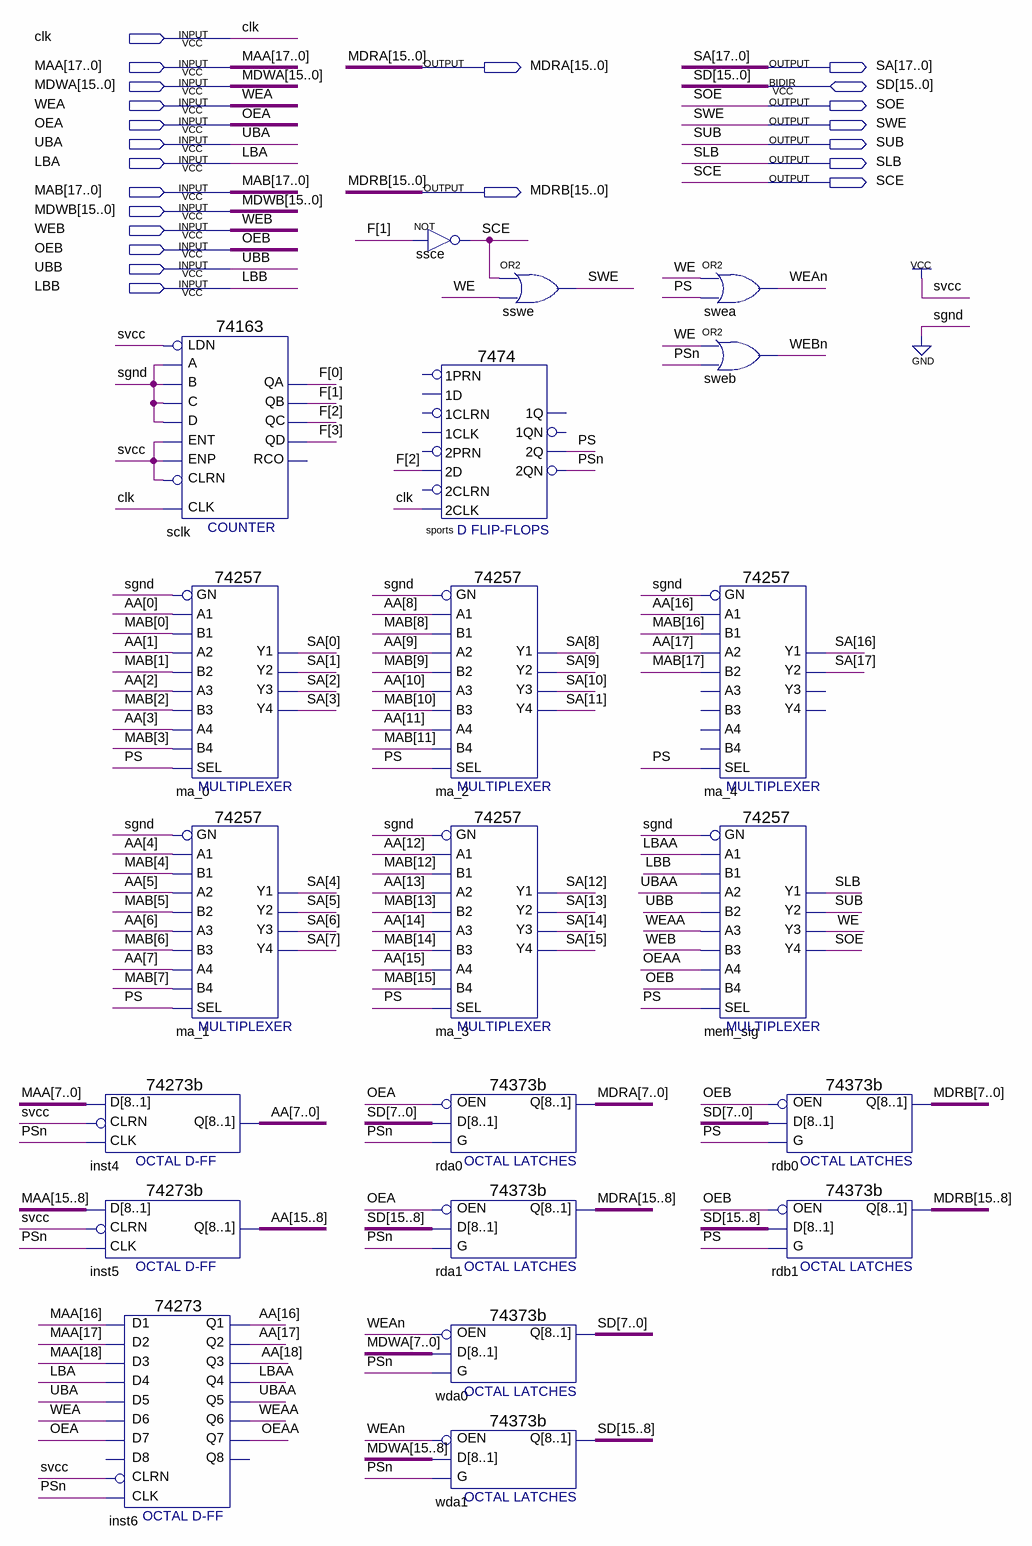
[diagram p0: schematic sheet]
// Quartus schematic orion_memory.bdf as structural Verilog: 21 symbols, 22 pins
module orion_memory (
  input  clk,
  input  [18:0] MAA,
  input  [15:0] MDWA,
  input  WEA,
  input  OEA,
  input  UBA,
  input  LBA,
  input  [17:0] MAB,
  input  [15:0] MDWB,
  input  WEB,
  input  OEB,
  input  UBB,
  input  LBB,
  inout  [15:0] SD,
  output [15:0] MDRA,
  output [17:0] SA,
  output SOE,
  output SWE,
  output SUB,
  output SLB,
  output SCE,
  output [15:0] MDRB
);

  wire LBAA, OEAA, PS, PSn, UBAA, WE, WEAA, WEAn, WEBn;
  wire [3:0] F;
  wire [18:0] AA;

  \74273b  inst4 (.CLK(PSn), .D(MAA[7:0]), .CLRN(1'b1), .Q(AA[7:0]));
  \74273b  inst5 (.CLK(PSn), .D(MAA[15:8]), .CLRN(1'b1), .Q(AA[15:8]));
  \74273  inst6 (
    .D2(MAA[17]), .D3(MAA[18]), .D1(MAA[16]), .D4(LBA), .D7(OEA), .D6(WEA), .D5(UBA), .CLK(PSn), .CLRN(1'b1),
    .Q4(LBAA), .Q1(AA[16]), .Q2(AA[17]), .Q3(AA[18]), .Q6(WEAA), .Q5(UBAA), .Q7(OEAA));  // open: D8, Q8
  \74163  sclk (
    .C(1'b0), .B(1'b0), .A(1'b0), .ENT(1'b1), .D(1'b0), .CLRN(1'b1), .CLK(clk), .ENP(1'b1), .LDN(1'b1),
    .QA(F[0]), .QB(F[1]), .QC(F[2]), .QD(F[3]));  // open: RCO
  \74257  ma_0 (
    .B1(MAB[0]), .A1(AA[0]), .B3(MAB[2]), .A2(AA[1]), .B2(MAB[1]), .A3(AA[2]), .A4(AA[3]), .B4(MAB[3]),
    .SEL(PS), .GN(1'b0), .Y2(SA[1]), .Y3(SA[2]), .Y4(SA[3]), .Y1(SA[0]));
  \74257  ma_1 (
    .B1(MAB[4]), .A1(AA[4]), .B3(MAB[6]), .A2(AA[5]), .B2(MAB[5]), .A3(AA[6]), .A4(AA[7]), .B4(MAB[7]),
    .SEL(PS), .GN(1'b0), .Y2(SA[5]), .Y3(SA[6]), .Y4(SA[7]), .Y1(SA[4]));
  not ssce (SCE, F[1]);
  \7474  sports (
    .\2D (F[2]), .\2CLK (clk), .\2Q (PS), .\2QN (PSn));  // open: 2PRN, 1CLK, 1D, 1PRN, 2CLRN, 1CLRN, 1QN, 1Q
  \74257  ma_2 (
    .B1(MAB[8]), .A1(AA[8]), .B3(MAB[10]), .A2(AA[9]), .B2(MAB[9]), .A3(AA[10]), .A4(AA[11]), .B4(MAB[11]),
    .SEL(PS), .GN(1'b0), .Y2(SA[9]), .Y3(SA[10]), .Y4(SA[11]), .Y1(SA[8]));
  \74257  ma_3 (
    .B1(MAB[12]), .A1(AA[12]), .B3(MAB[14]), .A2(AA[13]), .B2(MAB[13]), .A3(AA[14]), .A4(AA[15]),
    .B4(MAB[15]), .SEL(PS), .GN(1'b0), .Y2(SA[13]), .Y3(SA[14]), .Y4(SA[15]), .Y1(SA[12]));
  \74373b  rda0 (.D(SD[7:0]), .G(PSn), .OEN(OEA), .Q(MDRA[7:0]));
  \74373b  rda1 (.D(SD[15:8]), .G(PSn), .OEN(OEA), .Q(MDRA[15:8]));
  \74373b  wda0 (.D(MDWA[7:0]), .G(PSn), .OEN(WEAn), .Q(SD[7:0]));
  \74373b  wda1 (.D(MDWA[15:8]), .G(PSn), .OEN(WEAn), .Q(SD[15:8]));
  or sswe (SWE, SCE, WE);
  or swea (WEAn, WE, PS);
  or sweb (WEBn, WE, PSn);
  \74257  ma_4 (
    .B1(MAB[16]), .A1(AA[16]), .A2(AA[17]), .B2(MAB[17]), .SEL(PS), .GN(1'b0), .Y2(SA[17]), .Y1(SA[16]));  // open: B3, A3, A4, B4, Y3, Y4
  \74257  mem_sig (
    .B1(LBB), .A1(LBAA), .B3(WEB), .A2(UBAA), .B2(UBB), .A3(WEAA), .A4(OEAA), .B4(OEB), .SEL(PS), .GN(1'b0),
    .Y2(SUB), .Y3(WE), .Y4(SOE), .Y1(SLB));
  \74373b  rdb0 (.D(SD[7:0]), .G(PS), .OEN(OEB), .Q(MDRB[7:0]));
  \74373b  rdb1 (.D(SD[15:8]), .G(PS), .OEN(OEB), .Q(MDRB[15:8]));
endmodule
